# Altium schematic sheet Sheet_4.schdoc
size 265 x 199 mm
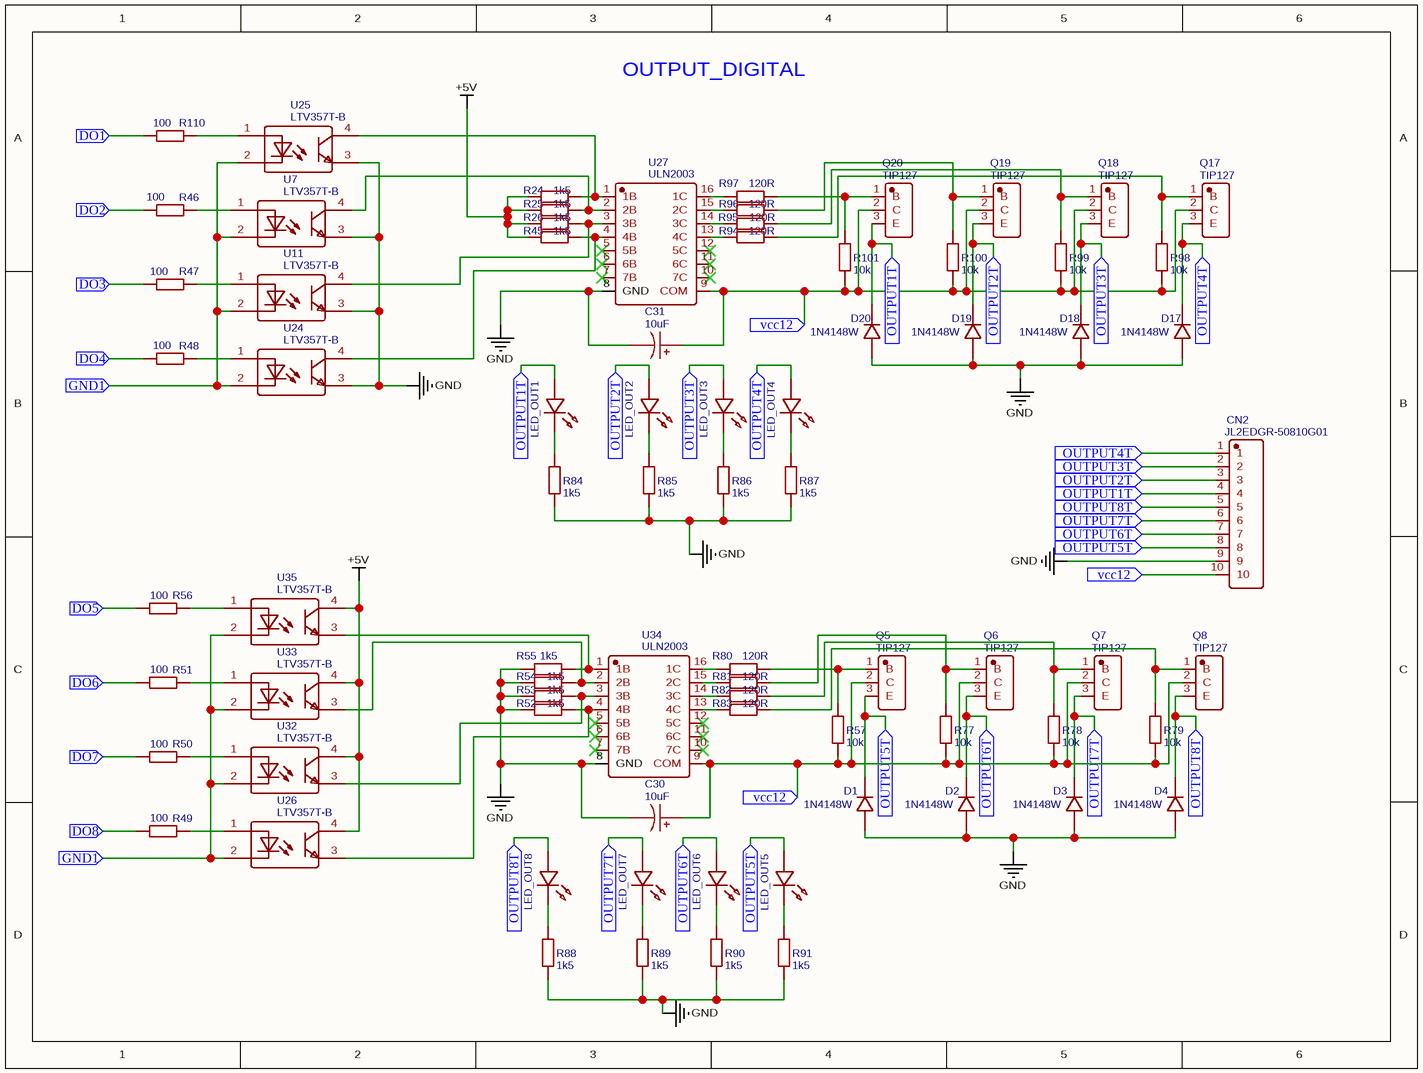
[diagram p0: Sheet_4.schdoc]

## Parts
C30  10uF  [CAP-TH_BD5.0-P2.00-D0.8-FD]
C31  10uF  [CAP-TH_BD5.0-P2.00-D0.8-FD]
CN2  JL2EDGR-50810G01  [CONN-TH_10P-P5.08_JL2EDGR]
D1  1N4148W  [SOD-123F_L2.7-W1.7-LS3.7-RD-1]
D2  1N4148W  [SOD-123F_L2.7-W1.7-LS3.7-RD-1]
D3  1N4148W  [SOD-123F_L2.7-W1.7-LS3.7-RD-1]
D4  1N4148W  [SOD-123F_L2.7-W1.7-LS3.7-RD-1]
D17  1N4148W  [SOD-123F_L2.7-W1.7-LS3.7-RD-1]
D18  1N4148W  [SOD-123F_L2.7-W1.7-LS3.7-RD-1]
D19  1N4148W  [SOD-123F_L2.7-W1.7-LS3.7-RD-1]
D20  1N4148W  [SOD-123F_L2.7-W1.7-LS3.7-RD-1]
LED_OUT1  red  [LED1206-RD]  (value not drawn)
LED_OUT2  red  [LED1206-RD]  (value not drawn)
LED_OUT3  red  [LED1206-RD]  (value not drawn)
LED_OUT4  red  [LED1206-RD]  (value not drawn)
LED_OUT5  red  [LED1206-RD]  (value not drawn)
LED_OUT6  red  [LED1206-RD]  (value not drawn)
LED_OUT7  red  [LED1206-RD]  (value not drawn)
LED_OUT8  red  [LED1206-RD]  (value not drawn)
Q5  TIP127  [TO-252-3_L6.5-W5.8-P4.58-TL]
Q6  TIP127  [TO-252-3_L6.5-W5.8-P4.58-TL]
Q7  TIP127  [TO-252-3_L6.5-W5.8-P4.58-TL]
Q8  TIP127  [TO-252-3_L6.5-W5.8-P4.58-TL]
Q17  TIP127  [TO-252-3_L6.5-W5.8-P4.58-TL]
Q18  TIP127  [TO-252-3_L6.5-W5.8-P4.58-TL]
Q19  TIP127  [TO-252-3_L6.5-W5.8-P4.58-TL]
Q20  TIP127  [TO-252-3_L6.5-W5.8-P4.58-TL]
R24  1k5  [R1206]
R25  1k5  [R1206]
R26  1k5  [R1206]
R45  1k5  [R1206]
R46  100  [R1206]
R47  100  [R1206]
R48  100  [R1206]
R49  100  [R1206]
R50  100  [R1206]
R51  100  [R1206]
R52  1k5  [R1206]
R53  1k5  [R1206]
R54  1k5  [R1206]
R55  1k5  [R1206]
R56  100  [R1206]
R57  10k  [R1206]
R77  10k  [R1206]
R78  10k  [R1206]
R79  10k  [R1206]
R80  120R  [R1206]
R81  120R  [R1206]
R82  120R  [R1206]
R83  120R  [R1206]
R84  1k5  [R1206]
R85  1k5  [R1206]
R86  1k5  [R1206]
R87  1k5  [R1206]
R88  1k5  [R1206]
R89  1k5  [R1206]
R90  1k5  [R1206]
R91  1k5  [R1206]
R94  120R  [R1206]
R95  120R  [R1206]
R96  120R  [R1206]
R97  120R  [R1206]
R98  10k  [R1206]
R99  10k  [R1206]
R100  10k  [R1206]
R101  10k  [R1206]
R110  100  [R1206]
U7  LTV357T-B  [SOP-4_L4.4-W4.0-P2.54-LS7.0-TL]
U11  LTV357T-B  [SOP-4_L4.4-W4.0-P2.54-LS7.0-TL]
U24  LTV357T-B  [SOP-4_L4.4-W4.0-P2.54-LS7.0-TL]
U25  LTV357T-B  [SOP-4_L4.4-W4.0-P2.54-LS7.0-TL]
U26  LTV357T-B  [SOP-4_L4.4-W4.0-P2.54-LS7.0-TL]
U27  ULN2003  [SOP-16_L9.9-W3.9-P1.27-LS6.0-BL]
U32  LTV357T-B  [SOP-4_L4.4-W4.0-P2.54-LS7.0-TL]
U33  LTV357T-B  [SOP-4_L4.4-W4.0-P2.54-LS7.0-TL]
U34  ULN2003  [SOP-16_L9.9-W3.9-P1.27-LS6.0-BL]
U35  LTV357T-B  [SOP-4_L4.4-W4.0-P2.54-LS7.0-TL]

## Ports
DO1 (in), DO2 (in), DO3 (in), DO4 (in), DO5 (in), DO6 (in), DO7 (in), DO8 (in), GND1 (in), OUTPUT1T (in), OUTPUT2T (in), OUTPUT3T (in), OUTPUT4T (in), OUTPUT5T (in), OUTPUT6T (in), OUTPUT7T (in), OUTPUT8T (in), vcc12 (in)

## Nets
+5V: R24.1 R25.2 R26.2 R45.2 U26.4 U32.4 U33.4 U35.4
GND: C30.2 C31.2 CN2.9 D1.2 D2.2 D3.2 D4.2 D17.2 D18.2 D19.2 D20.2 R52.2 R53.2 R54.2 R55.1 R84.2 R85.2 R86.2 R87.2 R88.2 R89.2 R90.2 R91.2 U7.3 U11.3 U24.3 U25.3 U27.8(GND) U34.8(GND)
DO1: R110.2 ; port DO1
DO2: R46.2 ; port DO2
DO3: R47.2 ; port DO3
DO4: R48.2 ; port DO4
DO5: R56.2 ; port DO5
DO6: R51.2 ; port DO6
DO7: R50.2 ; port DO7
DO8: R49.2 ; port DO8
GND1: U7.2 U11.2 U24.2 U25.2 U26.2 U32.2 U33.2 U35.2 ; port GND1
OUTPUT1T: CN2.4 D20.1 LED_OUT1.1 Q20.3(E) ; port OUTPUT1T
OUTPUT2T: CN2.3 D19.1 LED_OUT2.1 Q19.3(E) ; port OUTPUT2T
OUTPUT3T: CN2.2 D18.1 LED_OUT3.1 Q18.3(E) ; port OUTPUT3T
OUTPUT4T: CN2.1 D17.1 LED_OUT4.1 Q17.3(E) ; port OUTPUT4T
OUTPUT5T: CN2.8 D1.1 LED_OUT5.1 Q5.3(E) ; port OUTPUT5T
OUTPUT6T: CN2.7 D2.1 LED_OUT6.1 Q6.3(E) ; port OUTPUT6T
OUTPUT7T: CN2.6 D3.1 LED_OUT7.1 Q7.3(E) ; port OUTPUT7T
OUTPUT8T: CN2.5 D4.1 LED_OUT8.1 Q8.3(E) ; port OUTPUT8T
vcc12: C30.1 C31.1 CN2.10 Q5.2(C) Q6.2(C) Q7.2(C) Q8.2(C) Q17.2(C) Q18.2(C) Q19.2(C) Q20.2(C) R57.2 R77.2 R78.2 R79.2 R98.2 R99.2 R100.2 R101.2 U27.9(COM) U34.9(COM) ; port vcc12
NetLED_OUT1_2: LED_OUT1.2 R84.1
NetLED_OUT2_2: LED_OUT2.2 R85.1
NetLED_OUT3_2: LED_OUT3.2 R86.1
NetLED_OUT4_2: LED_OUT4.2 R87.1
NetLED_OUT5_2: LED_OUT5.2 R91.1
NetLED_OUT6_2: LED_OUT6.2 R90.1
NetLED_OUT7_2: LED_OUT7.2 R89.1
NetLED_OUT8_2: LED_OUT8.2 R88.1
NetQ5_1: Q5.1(B) R57.1 R80.1
NetQ6_1: Q6.1(B) R77.1 R81.1
NetQ7_1: Q7.1(B) R78.1 R82.1
NetQ8_1: Q8.1(B) R79.1 R83.1
NetQ17_1: Q17.1(B) R94.1 R98.1
NetQ18_1: Q18.1(B) R95.1 R99.1
NetQ19_1: Q19.1(B) R96.1 R100.1
NetQ20_1: Q20.1(B) R97.1 R101.1
NetR24_2: R24.2 U25.4 U27.1(1B)
NetR25_1: R25.1 U7.4 U27.2(2B)
NetR26_1: R26.1 U11.4 U27.3(3B)
NetR45_1: R45.1 U24.4 U27.4(4B)
NetR46_1: R46.1 U7.1
NetR47_1: R47.1 U11.1
NetR48_1: R48.1 U24.1
NetR49_1: R49.1 U26.1
NetR50_1: R50.1 U32.1
NetR51_1: R51.1 U33.1
NetR52_1: R52.1 U26.3 U34.4(4B)
NetR53_1: R53.1 U32.3 U34.3(3B)
NetR54_1: R54.1 U33.3 U34.2(2B)
NetR55_2: R55.2 U34.1(1B) U35.3
NetR56_1: R56.1 U35.1
NetR80_2: R80.2 U34.16(1C)
NetR81_2: R81.2 U34.15(2C)
NetR82_2: R82.2 U34.14(3C)
NetR83_2: R83.2 U34.13(4C)
NetR94_2: R94.2 U27.13(4C)
NetR95_2: R95.2 U27.14(3C)
NetR96_2: R96.2 U27.15(2C)
NetR97_2: R97.2 U27.16(1C)
NetR110_1: R110.1 U25.1

Not connected (* = marked no-connect by the designer): U27 5(5B)* 6(6B)* 7(7B)* 10(7C)* 11(6C)* 12(5C)*; U34 5(5B)* 6(6B)* 7(7B)* 10(7C)* 11(6C)* 12(5C)*

## Notes on the sheet
- OUTPUT_DIGITAL

## Library data of the parts
C30 C31 = 10uF: BOM_Manufacturer: KNSCHA; BOM_Manufacturer Part: 01EC1809SHC10UF50V; nameAlias: Capacitance; Contributor: LCSC; BOM_Supplier: LCSC; BOM_Supplier Part: C503219; BOM_JLCPCB Part Class: Extended Part; spicePre: C; spiceSymbolName: 01EC1809SHC10UF50V
CN2 = JL2EDGR-50810G01: BOM_Manufacturer: JILN; Contributor: LCSC; BOM_Supplier: LCSC; BOM_Supplier Part: C424394; BOM_Manufacturer Part: JL2EDGR-50810G01; BOM_JLCPCB Part Class: Extended Part; spicePre: C; spiceSymbolName: JL2EDGR-50810G01
D1-D4 D17-D20 = 1N4148W: BOM_Manufacturer: BLUE ROCKET; Contributor: LCSC; BOM_Supplier: LCSC; BOM_Supplier Part: C305437; BOM_Manufacturer Part: 1N4148W; BOM_JLCPCB Part Class: Extended Part; spicePre: D; spiceSymbolName: 1N4148W_C305437
LED_OUT1-LED_OUT8 = red: BOM_Manufacturer: HONGLITRONIC(Hongli Zhihui (HONGLITRONIC)); BOM_Manufacturer Part: HL-503H3GD; Contributor: LCSC; BOM_Supplier: LCSC; BOM_Supplier Part: C568941; spicePre: L; spiceSymbolName: HL-503H3GD
Q5-Q8 Q17-Q20 = TIP127: BOM_Manufacturer: YW; Contributor: LCSC; BOM_Supplier: LCSC; BOM_Supplier Part: C557885; BOM_Manufacturer Part: TIP127; BOM_JLCPCB Part Class: Extended Part; spicePre: Q; spiceSymbolName: TIP127_C557885
R24-R26 R45 R52-R55 R84-R91 = 1k5: BOM_Manufacturer: Chian Chia Elec; nameAlias: Resistance (Ohms); Contributor: LCSC; BOM_Supplier: LCSC; BOM_Supplier Part: C120038; BOM_Manufacturer Part: -; BOM_JLCPCB Part Class: Extended Part; spicePre: R; spiceSymbolName: CF1/4W-200Ω±5% T52
R46-R51 R56 R110 = 100: BOM_Manufacturer: Chian Chia Elec; nameAlias: Resistance (Ohms); Contributor: LCSC; BOM_Supplier: LCSC; BOM_Supplier Part: C120038; BOM_Manufacturer Part: -; BOM_JLCPCB Part Class: Extended Part; spicePre: R; spiceSymbolName: CF1/4W-200Ω±5% T52
R57 R77-R79 R98-R101 = 10k: BOM_Manufacturer: Chian Chia Elec; nameAlias: Resistance (Ohms); Contributor: LCSC; BOM_Supplier: LCSC; BOM_Supplier Part: C120038; BOM_Manufacturer Part: -; BOM_JLCPCB Part Class: Extended Part; spicePre: R; spiceSymbolName: CF1/4W-200Ω±5% T52
R80-R83 R94-R97 = 120R: BOM_Manufacturer: Chian Chia Elec; nameAlias: Resistance (Ohms); Contributor: LCSC; BOM_Supplier: LCSC; BOM_Supplier Part: C120038; BOM_Manufacturer Part: -; BOM_JLCPCB Part Class: Extended Part; spicePre: R; spiceSymbolName: CF1/4W-200Ω±5% T52
U7 U11 U24-U26 U32 U33 U35 = LTV357T-B: BOM_Manufacturer: LITEON; Contributor: LCSC; BOM_Supplier: LCSC; BOM_Manufacturer Part: LTV357T-B; BOM_Supplier Part: C33068; BOM_JLCPCB Part Class: Extended Part; spicePre: U; spiceSymbolName: LTV357T-B
U27 U34 = ULN2003: BOM_Manufacturer: CJ（江苏长电/长晶）; Contributor: LCSC; BOM_Supplier: LCSC; BOM_Supplier Part: C2829422; BOM_Manufacturer Part: ULN2003; BOM_JLCPCB Part Class: Extended Part; spicePre: U; spiceSymbolName: ULN2003_C2829422